# Altium project RocketFPGA.PrjPcb
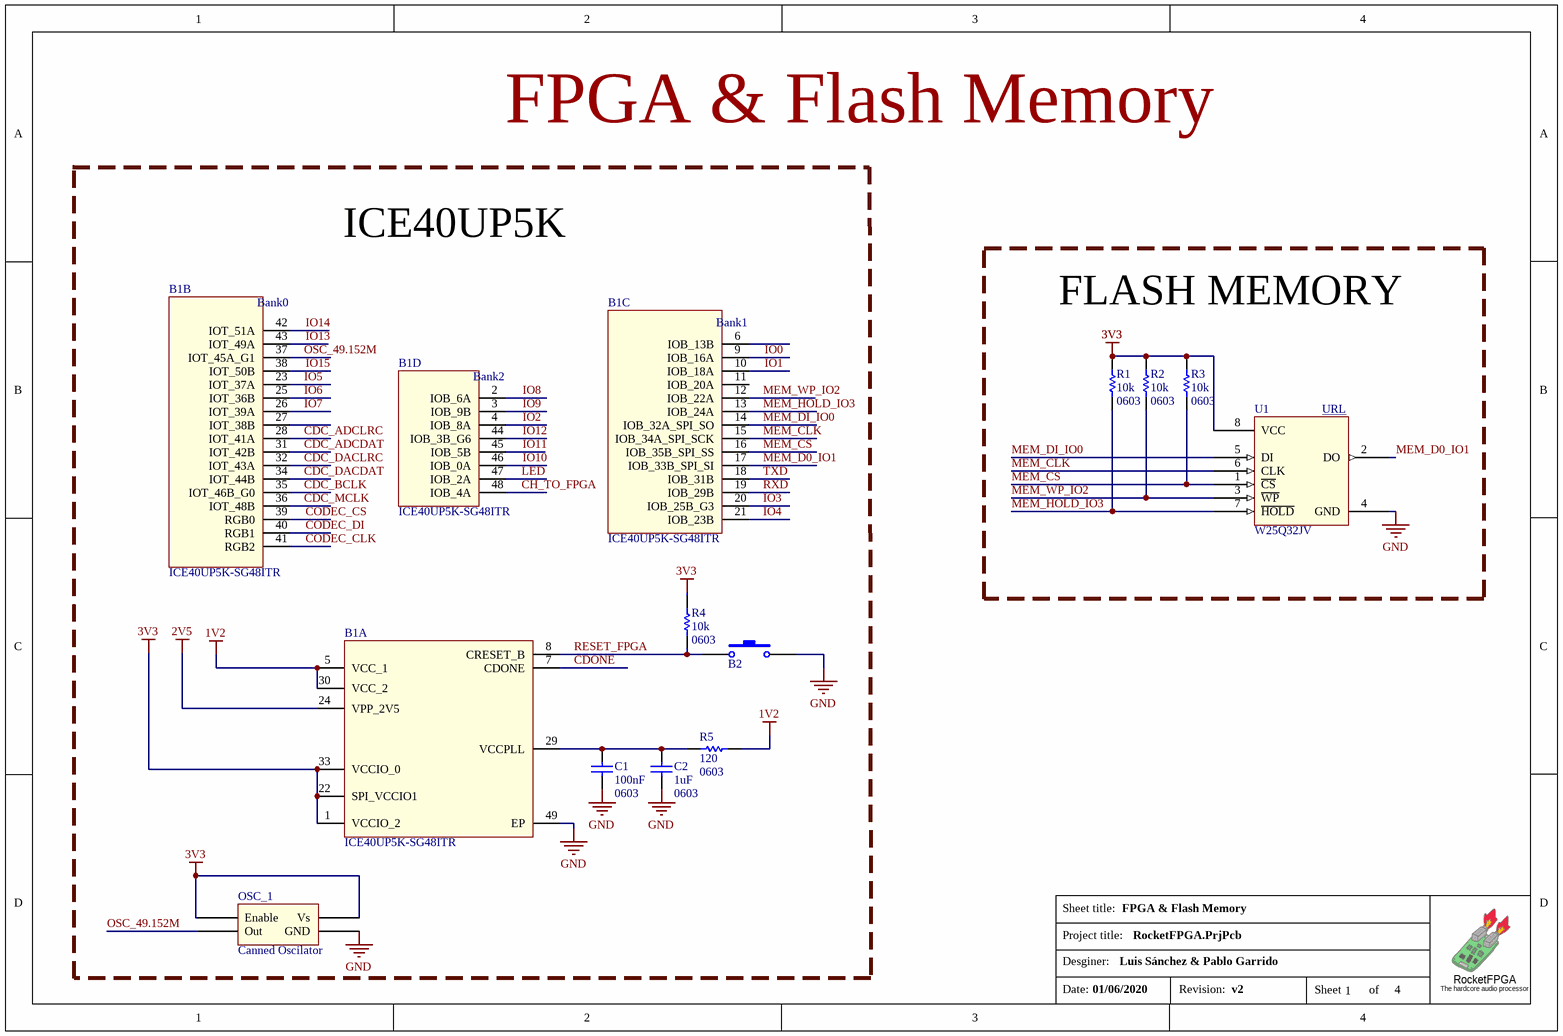
[diagram p0: 01_FPGA_FlashMem.SchDoc]
author_name: Luis Sánchez & Pablo Garrido; release_date: 01/06/2020; revision_no: v2
4 sheets, 58 parts. Net scope: global (net labels, ports and power ports of the same name join across sheets).
Board files: panel.PcbDoc, RocketFPGA.PcbDoc
Sheets:
  01_FPGA_FlashMem.SchDoc
  02_USB_MCU.SchDoc
  03_Power_IO.SchDoc
  04_AudioCodec.SchDoc

## Sheet 01_FPGA_FlashMem.SchDoc: FPGA & Flash Memory
size A4; Date: 08/06/2019; Author: Luis Sánchez Velasco; DocumentNumber: 1; Revision: 0; SheetNumber: 1; SheetTotal: 4; sheet_title: FPGA & Flash Memory

### Parts
(Parts that share a designator on the sheet are numbered #1, #2 ... from top to bottom, then left to right.)
B1  ICE40UP5K-SG48ITR  [QFN50P700X700X100-49N-D]  (parts A,B,C,D of 4)
B2  FSM6JH  [SMD_PUSHBUTTON_3x6x2mm5]  (value not drawn)
C1  value 100nF  Package: 0603  [0603 CAP]  (hidden comment: Ceramic capacitor)
C2  value 1uF  Package: 0603  [0603 CAP]  (hidden comment: Ceramic capacitor)
OSC_1#1  Canned Oscilator  [canned oscillator small]
R1  value 10k  Package: 0603  [Resistencia 0603]  (hidden comment: Resistor)
R2  value 10k  Package: 0603  [Resistencia 0603]  (hidden comment: Resistor)
R3  value 10k  Package: 0603  [Resistencia 0603]  (hidden comment: Resistor)
R4  value 10k  Package: 0603  [Resistencia 0603]  (hidden comment: Resistor)
R5  value 120  Package: 0603  [Resistencia 0603]  (hidden comment: Resistor)
U1  W25Q32JV  [W25Q32J]

### Blocks framed on the sheet
ICE40UP5K: B1 B2 C1 C2 OSC_1#1 R4 R5
FLASH MEMORY: R1-R3 U1

### Nets
1V2: B1.5(VCC_1) B1.30(VCC_2) R5.2
2V5: B1.24(VPP_2V5)
3V3: B1.1(VCCIO_2) B1.22(SPI_VCCIO1) B1.33(VCCIO_0) OSC_1#1.1(Enable) OSC_1#1.4(Vs) R1.2 R2.2 R3.2 R4.2 U1.8(VCC)
GND: B1.49(EP) B2.2 C1.1 C2.1 OSC_1#1.2(GND) U1.4(GND)
CDC_ADCDAT: B1.31(IOT_42B)
CDC_ADCLRC: B1.28(IOT_41A)
CDC_BCLK: B1.35(IOT_46B_G0)
CDC_DACDAT: B1.34(IOT_44B)
CDC_DACLRC: B1.32(IOT_43A)
CDC_MCLK: B1.36(IOT_48B)
CDONE: B1.7(CDONE)
CH_TO_FPGA: B1.48(IOB_4A)
CODEC_CLK: B1.41(RGB2)
CODEC_CS: B1.39(RGB0)
CODEC_DI: B1.40(RGB1)
IO0: B1.9(IOB_16A)
IO1: B1.10(IOB_18A)
IO2: B1.4(IOB_8A)
IO3: B1.20(IOB_25B_G3)
IO4: B1.21(IOB_23B)
IO5: B1.23(IOT_37A)
IO6: B1.25(IOT_36B)
IO7: B1.26(IOT_39A)
IO8: B1.2(IOB_6A)
IO9: B1.3(IOB_9B)
IO10: B1.46(IOB_0A)
IO11: B1.45(IOB_5B)
IO12: B1.44(IOB_3B_G6)
IO13: B1.43(IOT_49A)
IO14: B1.42(IOT_51A)
IO15: B1.38(IOT_50B)
LED: B1.47(IOB_2A)
MEM_CLK: B1.15(IOB_34A_SPI_SCK) U1.6(CLK)
MEM_CS: B1.16(IOB_35B_SPI_SS) R3.1 U1.1(~{CS})
MEM_D0_IO1: B1.17(IOB_33B_SPI_SI) U1.2(DO)
MEM_DI_IO0: B1.14(IOB_32A_SPI_SO) U1.5(DI)
MEM_HOLD_IO3: B1.13(IOB_24A) R1.1 U1.7(~{HOLD})
MEM_WP_IO2: B1.12(IOB_22A) R2.1 U1.3(~{WP})
OSC_49.152M: B1.37(IOT_45A_G1) OSC_1#1.3(Out)
RESET_FPGA: B1.8(CRESET_B) B2.1 R4.1
RXD: B1.19(IOB_29B)
TXD: B1.18(IOB_31B)
NetB1_29: B1.29(VCCPLL) C1.2 C2.2 R5.1

Not connected (* = marked no-connect by the designer): B1 6(IOB_13B) 11(IOB_20A) 27(IOT_38B)

### Notes on the sheet
- FPGA & Flash Memory
- (near U1) URL <https://eu.mouser.com/ProductDetail/STMicroelectronics/M95M02-DWMN3TP-K?qs=sGAEpiMZZMuVhdAcoizlRYly6JnwLZjJGi2czB2d%252bG8%3d>
- Sheet title:
- Project title:
- Desginer:
- The hardcore audio processor
- RocketFPGA
- Date:
- Revision:
- Sheet
- of
- (in symbol ICE40UP5K-SG48ITR, part B) Bank0
- (in symbol ICE40UP5K-SG48ITR, part C) Bank1
- (in symbol ICE40UP5K-SG48ITR, part D) Bank2

### Library data of the parts
B1 = ICE40UP5K-SG48ITR: FPGA - Field Programmable Gate Array iCE40-UltraPlus, 5280 LUTs, 1.2V; Vendor: Mouser; Link: https://www.mouser.es/ProductDetail/Lattice/ICE40UP5K-SG48I?qs=Rp3RbKSfAt3UqOG1AN4%2FAg%3D%3D
B2 = FSM6JH: Button THT Switch; vendor: Mouser; vendorID: 611-PTS636SL43SMTRLF; Supplier 1: Mouser; Supplier Part Number 1: 506-FSM6JH; price: 0.096
C1 = Capacitor: vendor: LCSC; vendorID: 0603F104M500NT; Supplier 1: Mouser; Supplier Part Number 1: 80-C1206C104K5R; ManufacturerReference: -; price: 0.0023
C2 = Capacitor: vendor: LCSC; vendorID: CC0603ZRY5V7BB105; Supplier 1: Mouser; Supplier Part Number 1: 80-C1206C104K5R; ManufacturerReference: -; price: 0.0053
OSC_1#1 = Canned Oscilator: Canned Oscilator -LFSPXO019116BULK; Vendor: LCSC; Link: https://lcsc.com/product-detail/SMD-Oscillators-XO_Shenzhen-SCTF-Elec-S3D49-152000B20F30T_C387443.html
R1-R4 = Resistor: vendor: LCSC; vendorID: 0603WAF1002T5E; Supplier 1: Farnell; Supplier Part Number 1: 2358436; ManufacturerReference: -; price: 0.0009
  R1: Parameter 1: *
R5 = Resistor: vendor2: vendor; vendor: LCSC; vendorID: CR0603FA1200G; Supplier 1: Farnell; Supplier Part Number 1: 2358436; ManufacturerReference: -; price: 0.0024
U1 = W25Q32JV: 32M-BIT SERIAL FLASH MEMORY WITH DUAL AND QUAD SPI; Vendor: LCSC; Link: https://lcsc.com/product-detail/FLASH_Winbond-Elec-W25Q32JVSSIQ_C82344.html

## Sheet 02_USB_MCU.SchDoc: USB & Microcontroller
size A4; Date: 08/06/2019; Author: Luis Sánchez Velasco; DocumentNumber: 2; Revision: 0; SheetNumber: 2; SheetTotal: 4; sheet_title: USB Microcontroller
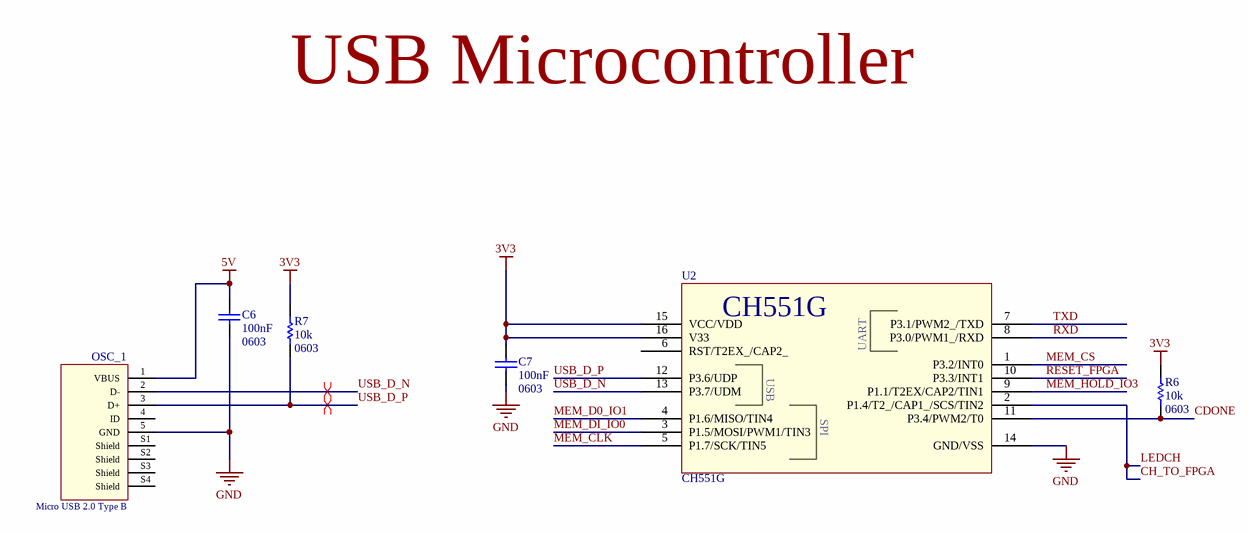
[diagram p1: 02_USB_MCU.SchDoc]

### Parts
(Parts that share a designator on the sheet are numbered #1, #2 ... from top to bottom, then left to right.)
C6  value 100nF  Package: 0603  [0603 CAP]  (hidden comment: Ceramic capacitor)
C7  value 100nF  Package: 0603  [0603 CAP]  (hidden comment: Ceramic capacitor)
OSC_1#2  Micro USB 2.0 Type B  [629105136821]
R6  value 10k  Package: 0603  [Resistencia 0603]  (hidden comment: Resistor)
R7  value 10k  Package: 0603  [Resistencia 0603]  (hidden comment: Resistor)
U2  CH551G  [CH551]

### Nets
3V3: C7.1 R6.2 R7.1 U2.15(VCC/VDD) U2.16(V33)
5V: C6.1 OSC_1#2.1(VBUS)
GND: C6.2 C7.2 OSC_1#2.5(GND) U2.14(GND/VSS)
CDONE: R6.1 U2.11(P3.4/PWM2/T0)
CH_TO_FPGA: U2.2(P1.4/T2_/CAP1_/SCS/TIN2)  [also labelled LEDCH]
MEM_CLK: U2.5(P1.7/SCK/TIN5)
MEM_CS: U2.1(P3.2/INT0)
MEM_D0_IO1: U2.4(P1.6/MISO/TIN4)
MEM_DI_IO0: U2.3(P1.5/MOSI/PWM1/TIN3)
MEM_HOLD_IO3: U2.9(P1.1/T2EX/CAP2/TIN1)
RESET_FPGA: U2.10(P3.3/INT1)
RXD: U2.8(P3.0/PWM1_/RXD)
TXD: U2.7(P3.1/PWM2_/TXD)
USB_D_N: OSC_1#2.2(D-) U2.13(P3.7/UDM)
USB_D_P: OSC_1#2.3(D+) R7.2 U2.12(P3.6/UDP)

Not connected (* = marked no-connect by the designer): OSC_1#2 4(ID) S1(Shield) S2(Shield) S3(Shield) S4(Shield); U2 6(RST/T2EX_/CAP2_)

### Layout directives
differential pair: USB_D_N, USB_D_P

### Notes on the sheet
- USB Microcontroller
- Sheet title:
- Project title:
- Desginer:
- The hardcore audio processor
- RocketFPGA
- Date:
- Revision:
- Sheet
- of
- (in symbol CH551G) UART; USB; SPI

### Library data of the parts
C6 C7 = Capacitor: vendor: LCSC; vendorID: 0603F104M500NT; Supplier 1: Mouser; Supplier Part Number 1: 80-C1206C104K5R; ManufacturerReference: -; price: 0.0023
OSC_1#2 = 629105136821: Micro USB 2.0 Type B Horizontal SMT 5 Contacts WR-COM; Vendor: LCSC; Vendor 2: Mouser; Link: https://lcsc.com/product-detail/USB-Connectors_Jing-Extension-of-the-Electronic-Co-Jing-Extension-of-the-Electronic-Co-micro-5PAll-posts-are-not-guided-Flat-welding-High-temperature_C77238.html; ComponentLink1Description: Manufacturer; ComponentLink1URL: http://www.we-online.de; ComponentLink2Description: Datasheet; ComponentLink2URL: http://katalog.we-online.de/em/datasheet/629105136821.pdf; Link 2: https://www.mouser.es/ProductDetail/Wurth-Elektronik/629105136821?qs=%2Fha2pyFaduiBjBt32de63eUvWSiL1Vrl53OTMO%252B7qnQKl4r3Xe3wDQ%3D%3D
R6 R7 = Resistor: vendor: LCSC; vendorID: 0603WAF1002T5E; Supplier 1: Farnell; Supplier Part Number 1: 2358436; ManufacturerReference: -; price: 0.0009
  R6: Parameter 1: *
U2 = CH551G: Microcontroller wUSB support; Vendor: LCSC; ComponentLink1Description: LCSC; ComponentLink1URL: https://lcsc.com/product-detail/USB_CH551G_C108958.html; Link: https://lcsc.com/product-detail/WCH_WCH-Jiangsu-Qin-Heng-CH551G_C108958.html

## Sheet 03_Power_IO.SchDoc
size A4; sheet_title: Power & IO; DocumentNumber: 3; SheetNumber: 3; SheetTotal: 4
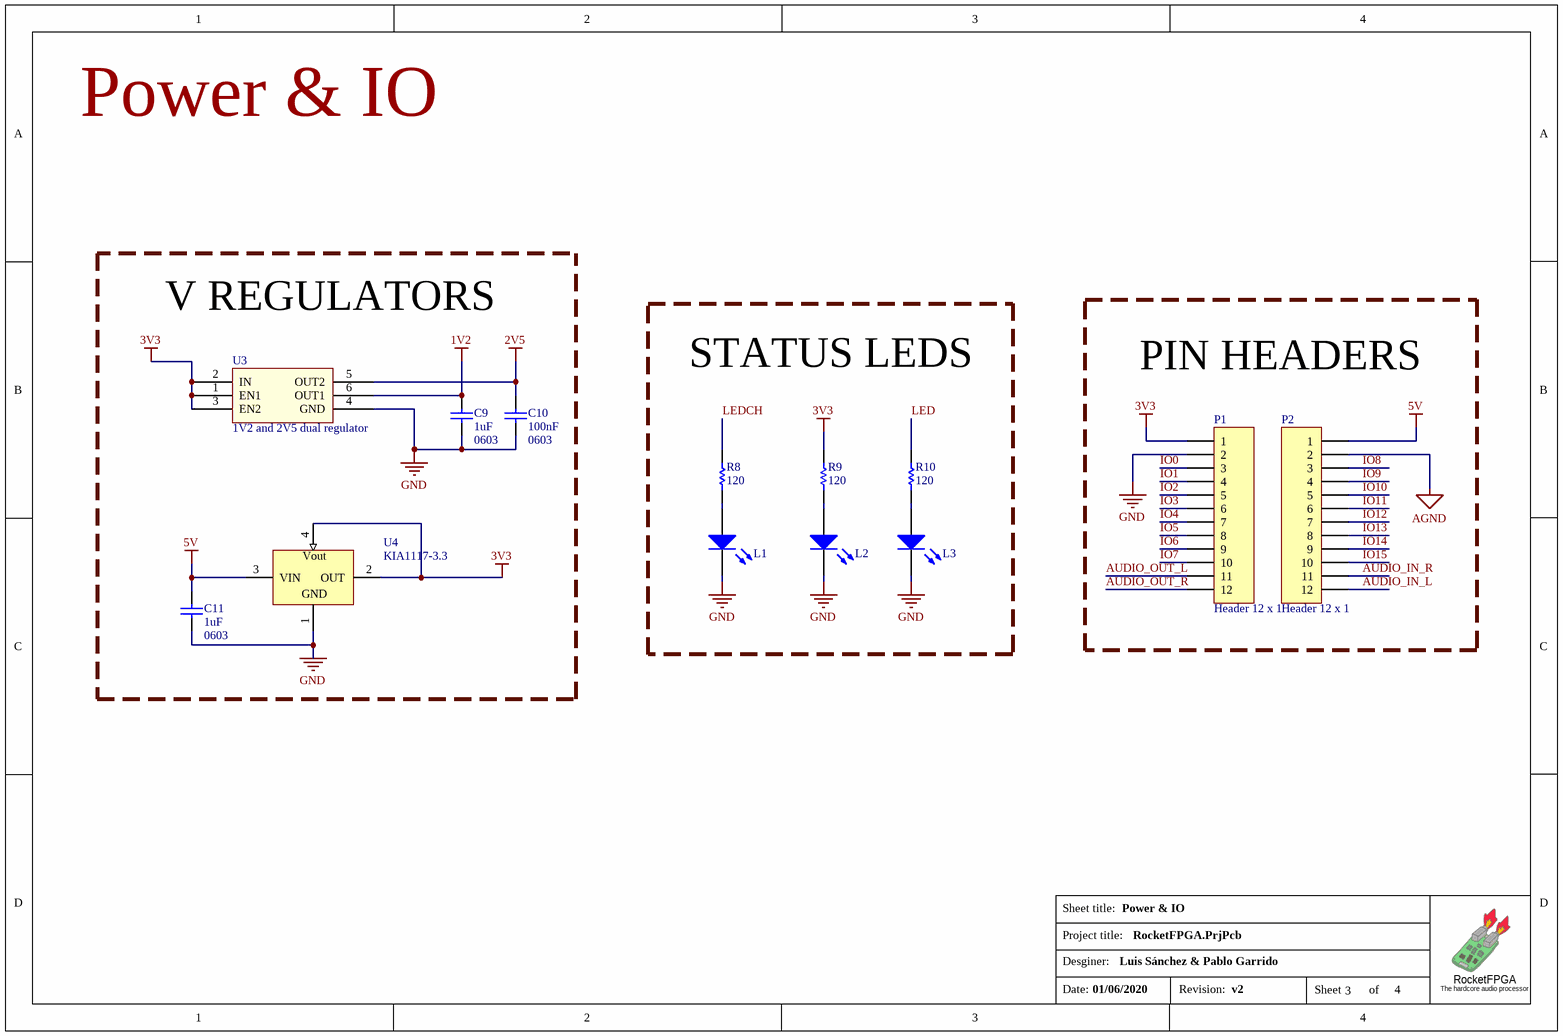
[diagram p2: 03_Power_IO.SchDoc]

### Parts
C9  value 1uF  Package: 0603  [0603 CAP]  (hidden comment: Ceramic capacitor)
C10  value 100nF  Package: 0603  [0603 CAP]  (hidden comment: Ceramic capacitor)
C11  value 1uF  Package: 0603  [0603 CAP]  (hidden comment: Ceramic capacitor)
L1  LED_SMD  [0805]  (value not drawn)
L2  LED_SMD  [0805]  (value not drawn)
L3  LED_SMD  [0805]  (value not drawn)
P1  Header 12 x 1  [HDR1X12]
P2  Header 12 x 1  [HDR1X12]
R8  value 120  [Resistencia 0603]  (hidden comment: Resistor)
R9  value 120  [Resistencia 0603]  (hidden comment: Resistor)
R10  value 120  [Resistencia 0603]  (hidden comment: Resistor)
U3  1V2 and 2V5 dual regulator  [DSE 6]
U4  KIA1117-3.3  [SOT-223]

### Blocks framed on the sheet
PIN HEADERS: P1 P2
STATUS LEDS: L1-L3 R8-R10

### Nets
1V2: C9.1 U3.6(OUT1)
2V5: C10.1 U3.5(OUT2)
3V3: P1.1 R9.2 U3.1(EN1) U3.2(IN) U3.3(EN2) U4.2(OUT) U4.4(Vout)
5V: C11.1 P2.1 U4.3(VIN)
AGND: P2.2
GND: C9.2 C10.2 C11.2 L1.2(K) L2.2(K) L3.2(K) P1.2 U3.4(GND) U4.1(GND)
AUDIO_IN_L: P2.12
AUDIO_IN_R: P2.11
AUDIO_OUT_L: P1.11
AUDIO_OUT_R: P1.12
IO0: P1.3
IO1: P1.4
IO2: P1.5
IO3: P1.6
IO4: P1.7
IO5: P1.8
IO6: P1.9
IO7: P1.10
IO8: P2.3
IO9: P2.4
IO10: P2.5
IO11: P2.6
IO12: P2.7
IO13: P2.8
IO14: P2.9
IO15: P2.10
LED: R10.2
LEDCH: R8.2  [project net CH_TO_FPGA]
NetL1_1: L1.1(A) R8.1
NetL2_1: L2.1(A) R9.1
NetL3_1: L3.1(A) R10.1

### Notes on the sheet
- Power & IO
- V REGULATORS
- Sheet title:
- Project title:
- Desginer:
- The hardcore audio processor
- RocketFPGA
- Date:
- Revision:
- Sheet
- of

### Library data of the parts
C9 C11 = Capacitor: as C2 on sheet 01_FPGA_FlashMem; Supplier 1: Mouser; Supplier Part Number 1: 80-C1206C104K5R; ManufacturerReference: -; price: 0.0053
C10 = Capacitor: vendor: LCSC; vendorID: 0603F104M500NT; Supplier 1: Mouser; Supplier Part Number 1: 80-C1206C104K5R; ManufacturerReference: -; price: 0.0023
L1-L3 = LED_SMD: LED SMD; vendor: Mouser; vendorID: 743-IN-S85AT5B; Supplier 1: Mouser; Supplier Part Number 1: 630-HSMC-C170; price: 0.087
P1 P2 = Header 12_1: Header, 11-Pin; Vendor: LCSC; Link: https://lcsc.com/product-detail/Pin-Header-Female-Header_CJT-Changjiang-Connectors-A2541WV-12P_C225487.html
R8-R10 = Resistor: as R5 on sheet 01_FPGA_FlashMem; Supplier 1: Farnell; Supplier Part Number 1: 2358436; price: 0.0024
U3 = TLV7111225DSER: Vendor: LCSC; Link: https://lcsc.com/product-detail/Low-Dropout-Regulators-LDO_Texas-Instruments-TLV7111225DSER_C201579.html
U4 = KIA1117-3.3: 5V to 3.3V 800mA Low-Dropout Linear Regulator; Vendor: LCSC; Link: https://lcsc.com/product-detail/Low-Dropout-Regulators-LDO_PUOLOP-AMS1117-3-3_C351784.html

## Sheet 04_AudioCodec.SchDoc
size A4; DocumentNumber: 4; SheetNumber: 4; SheetTotal: 4; sheet_title: Audio Codec
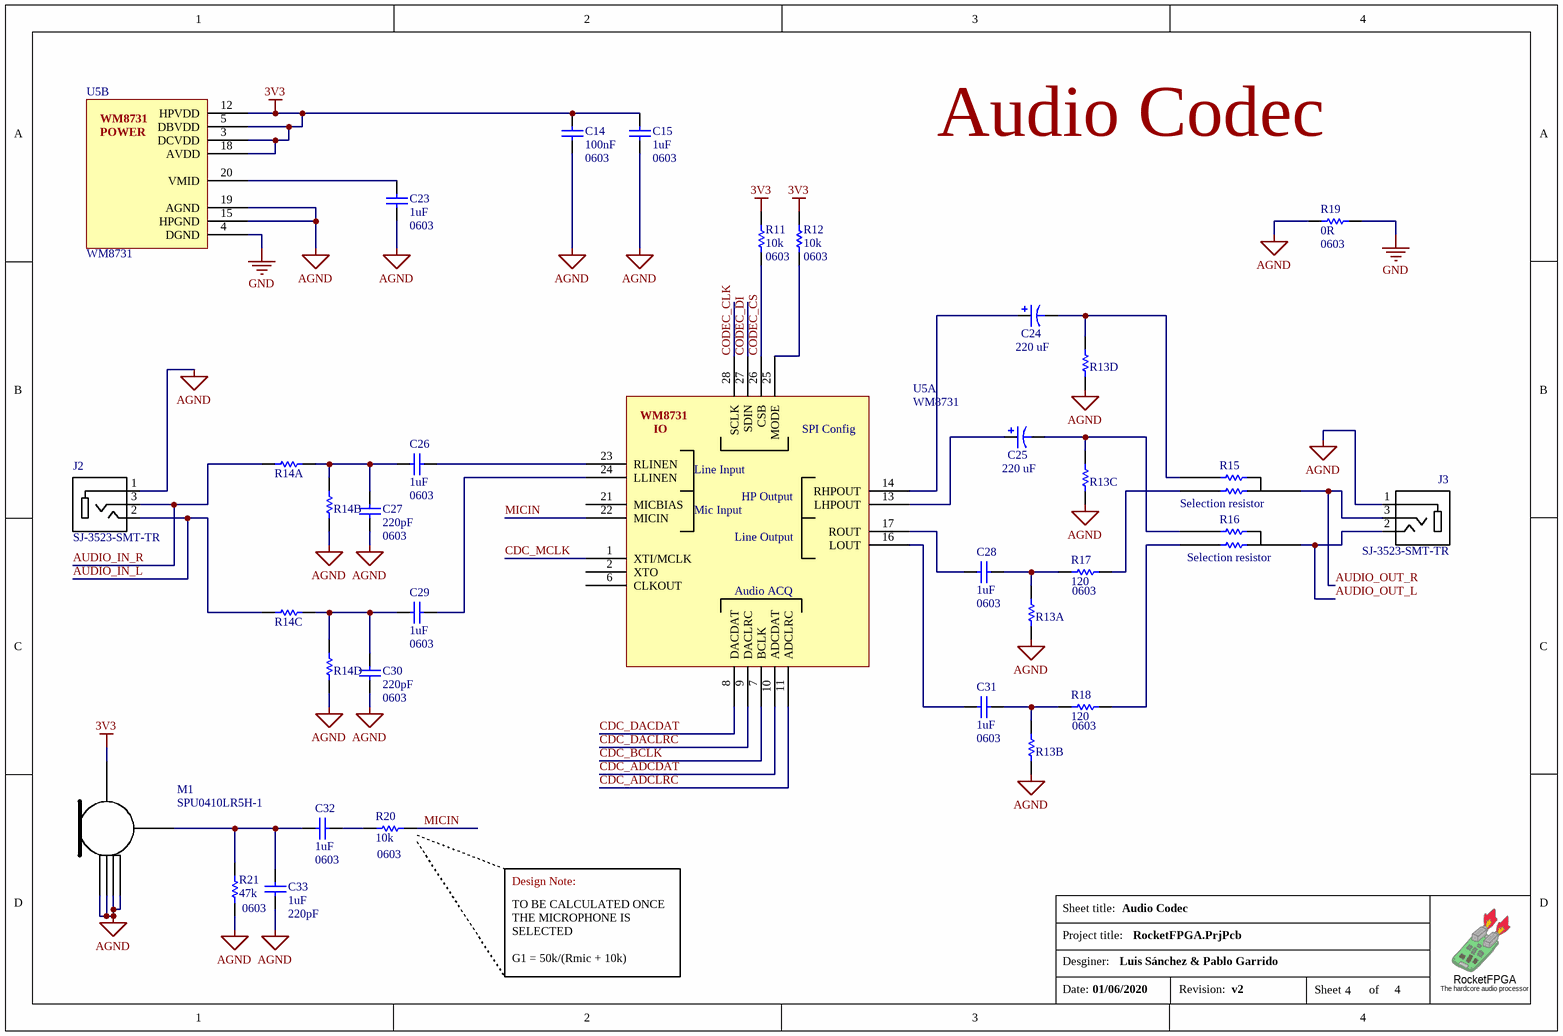
[diagram p3: 04_AudioCodec.SchDoc]

### Parts
C14  value 100nF  Package: 0603  [0603 CAP]  (hidden comment: Ceramic capacitor)
C15  value 1uF  Package: 0603  [0603 CAP]  (hidden comment: Ceramic capacitor)
C23  value 1uF  Package: 0603  [0603 CAP]  (hidden comment: Ceramic capacitor)
C24  value 220 uF  [CAPCP3216X16N]  (hidden comment: Capacitor Electrolitic)
C25  value 220 uF  [CAPCP3216X16N]  (hidden comment: Capacitor Electrolitic)
C26  value 1uF  Package: 0603  [0603 CAP]  (hidden comment: Ceramic capacitor)
C27  value 220pF  Package: 0603  [0603 CAP]  (hidden comment: Ceramic capacitor)
C28  value 1uF  Package: 0603  [0603 CAP]  (hidden comment: Ceramic capacitor)
C29  value 1uF  Package: 0603  [0603 CAP]  (hidden comment: Ceramic capacitor)
C30  value 220pF  Package: 0603  [0603 CAP]  (hidden comment: Ceramic capacitor)
C31  value 1uF  Package: 0603  [0603 CAP]  (hidden comment: Ceramic capacitor)
C32  value 1uF  Package: 0603  [0603 CAP]  (hidden comment: Ceramic capacitor)
C33  value 1uF  Package: 220pF  [0603 CAP]  (hidden comment: Ceramic capacitor)
J2  SJ-3523-SMT-TR  [CUI_SJ-3523-SMT-TR]
J3  SJ-3523-SMT-TR  [CUI_SJ-3523-SMT-TR]
M1  SPU0410LR5H-1  [SPU0410LR5H-1]
R11  value 10k  Package: 0603  [Resistencia 0603]  (hidden comment: Resistor)
R12  value 10k  Package: 0603  [Resistencia 0603]  (hidden comment: Resistor)
R13  Resistor array  (value not drawn)  (parts A,B,C,D of 4)
R14  Resistor array  (value not drawn)  (parts A,B,C,D of 4)
R15  Selection resistor
R16  Selection resistor
R17  value 120  Package: 0603  [Resistencia 0603]  (hidden comment: Resistor)
R18  value 120  Package: 0603  [Resistencia 0603]  (hidden comment: Resistor)
R19  value 0R  Package: 0603  [Resistencia 0603]  (hidden comment: Resistor)
R20  value 10k  Package: 0603  [Resistencia 0603]  (hidden comment: Resistor)
R21  value 47k  Package: 0603  [Resistencia 0603]  (hidden comment: Resistor)
U5  WM8731  [WM8731]  (parts A,B of 2)

### Nets
3V3: C14.1 C15.1 M1.4 R11.2 R12.2 U5.3(DCVDD) U5.5(DBVDD) U5.12(HPVDD) U5.18(AVDD)
AGND: C14.2 C15.2 C23.2 C27.2 C30.2 C33.2 J2.1 J3.1 M1.2 M1.3 M1.5 M1.6 R13.5 R13.6 R13.7 R13.8 R14.2 R14.4 R19.2 R21.1 U5.15(HPGND) U5.19(AGND)
GND: R19.1 U5.4(DGND)
AUDIO_IN_L: J2.2 R14.3
AUDIO_IN_R: J2.3 R14.1
AUDIO_OUT_L: J3.2 R16.2
AUDIO_OUT_R: J3.3 R15.2
CDC_ADCDAT: U5.10(ADCDAT)
CDC_ADCLRC: U5.11(ADCLRC)
CDC_BCLK: U5.7(BCLK)
CDC_DACDAT: U5.8(DACDAT)
CDC_DACLRC: U5.9(DACLRC)
CDC_MCLK: U5.1(XTI/MCLK)
CODEC_CLK: U5.28(SCLK)
CODEC_CS: R11.1 U5.26(CSB)
CODEC_DI: U5.27(SDIN)
MICIN: R20.2 U5.22(MICIN)
NetC23_1: C23.1 U5.20(VMID)
NetC24_1: C24.1 U5.14(RHPOUT)
NetC24_2: C24.2 R13.4 R15.1
NetC25_1: C25.1 U5.13(LHPOUT)
NetC25_2: C25.2 R13.3 R16.1
NetC26_1: C26.1 C27.1 R14.7 R14.8
NetC26_2: C26.2 U5.23(RLINEN)
NetC28_1: C28.1 U5.17(ROUT)
NetC28_2: C28.2 R13.1 R17.1
NetC29_1: C29.1 U5.24(LLINEN)
NetC29_2: C29.2 C30.1 R14.5 R14.6
NetC31_1: C31.1 U5.16(LOUT)
NetC31_2: C31.2 R13.2 R18.1
NetC32_1: C32.1 R20.1
NetC32_2: C32.2 C33.1 M1.1 R21.2
NetR12_1: R12.1 U5.25(MODE)
NetR15_3: R15.3 R17.2
NetR16_3: R16.3 R18.2

Not connected (* = marked no-connect by the designer): U5 2(XTO) 6(CLKOUT) 21(MICBIAS)

### Notes on the sheet
- Audio Codec
- Design Note:
- TO BE CALCULATED ONCE THE MICROPHONE IS SELECTED
  G1 = 50k/(Rmic + 10k)
- Sheet title:
- Project title:
- Desginer:
- The hardcore audio processor
- RocketFPGA
- Date:
- Revision:
- Sheet
- of
- (in symbol WM8731, part A) IO; SPI Config; Line Input; HP Output; Mic Input; Line Output; Audio ACQ
- (in symbol WM8731, part B) POWER

### Library data of the parts
C14 = Capacitor: vendor: LCSC; vendorID: 0603F104M500NT; Supplier 1: Mouser; Supplier Part Number 1: 80-C1206C104K5R; ManufacturerReference: -; price: 0.0023
C15 C23 C26 C28 C29 C31-C33 = Capacitor: as C2 on sheet 01_FPGA_FlashMem; Supplier 1: Mouser; Supplier Part Number 1: 80-C1206C104K5R; ManufacturerReference: -; price: 0.0053
C24 C25 = Capacitor Electrolitic: Vendor: LCSC; Author: Jaime Jiménez Ortega; Date: 21/05/2009; Link: https://lcsc.com/product-detail/Others_TANCAP-Tech-CA45-227M004BT_C327726.html
C27 C30 = Capacitor: vendor: LCSC; vendorID: 0603B221K500NT; Supplier 1: Mouser; Supplier Part Number 1: 80-C1206C104K5R; ManufacturerReference: -; price: 0.0035
J2 = SJ-3523-SMT-TR: Jack connector; vendor: Mouser; Vendor 2: LCSC; Link 2: https://lcsc.com/product-detail/Audio-Video-Connectors_BOOMELE-Boom-Precision-Elec-PJ-320B_C18594.html; Link: https://www.mouser.es/ProductDetail/CUI-Devices/SJ-3523-SMT-TR?qs=WyjlAZoYn51zOHzJ3r4ZRA%3D%3D
J3 = SJ-3523-SMT-TR: vendor: Mouser; vendorID: 490-SJ-3523-SMT-TR; ManufacturerReference: SJ-3523-SMT-TR; Package: -; price: 0.777
M1 = SPU0410LR5H-1: MEMS Microphone; Vendor: Mouser; Link: https://www.mouser.es/ProductDetail/Knowles/SPU0410LR5H-QB?qs=%2Fha2pyFadujsOyq9m86PskfJJTo%2F6w8gLVlLZDQM1tgnAEafFx2amg%3D%3D
R11 R12 R20 = Resistor: vendor: LCSC; vendorID: 0603WAF1002T5E; Supplier 1: Farnell; Supplier Part Number 1: 2358436; ManufacturerReference: -; price: 0.0009
R13 R14 = ResistorArray_4: 4 resistors in smd array configuration; Vendor: LCSC; Link: https://lcsc.com/product-detail/Resistor-Networks-Arrays_BOURNS_CAT10-562J4LF_BOURNS-CAT10-562J4LF_C148532.html; Link 2: https://lcsc.com/product-detail/Resistor-Networks-Arrays_BOURNS_CAT10-473J4LF_47KR-473-5_C148526.html
R15 R16 = SelectionResistor
R17 R18 = Resistor: vendor: LCSC; vendorID: CR0603FA1200G; Supplier 1: Farnell; Supplier Part Number 1: 2358436; ManufacturerReference: -; price: 0.0024
R19 R21 = Resistor: vendor: LCSC; vendorID: RS-03K473JT; Supplier 1: Farnell; Supplier Part Number 1: 2358436; ManufacturerReference: -; price: 0.0007
U5 = WM8731: Portable Internet Audio CODEC with Headphone Driver  and Programmable Sample Rates; Vendor: Mouser; Link: https://www.mouser.es/ProductDetail/Cirrus-Logic/WM8731CSEFL?qs=3kEcuH7qFhd2WZOaNm6tsA%3D%3D

## Nets that join several sheets
1V2: 01_FPGA_FlashMem (B1.5 B1.30 R5.2), 03_Power_IO (C9.1 U3.6)
2V5: 01_FPGA_FlashMem (B1.24), 03_Power_IO (C10.1 U3.5)
3V3: 01_FPGA_FlashMem (10 pins), 02_USB_MCU (5 pins), 03_Power_IO (7 pins), 04_AudioCodec (9 pins)
5V: 02_USB_MCU (C6.1 OSC_1#2.1), 03_Power_IO (C11.1 P2.1 U4.3)
AGND: 03_Power_IO (P2.2), 04_AudioCodec (22 pins)
GND: 01_FPGA_FlashMem (6 pins), 02_USB_MCU (C6.2 C7.2 OSC_1#2.5 U2.14), 03_Power_IO (9 pins), 04_AudioCodec (R19.1 U5.4)
AUDIO_IN_L: 03_Power_IO (P2.12), 04_AudioCodec (J2.2 R14.3)
AUDIO_IN_R: 03_Power_IO (P2.11), 04_AudioCodec (J2.3 R14.1)
AUDIO_OUT_L: 03_Power_IO (P1.11), 04_AudioCodec (J3.2 R16.2)
AUDIO_OUT_R: 03_Power_IO (P1.12), 04_AudioCodec (J3.3 R15.2)
CDC_ADCDAT: 01_FPGA_FlashMem (B1.31), 04_AudioCodec (U5.10)
CDC_ADCLRC: 01_FPGA_FlashMem (B1.28), 04_AudioCodec (U5.11)
CDC_BCLK: 01_FPGA_FlashMem (B1.35), 04_AudioCodec (U5.7)
CDC_DACDAT: 01_FPGA_FlashMem (B1.34), 04_AudioCodec (U5.8)
CDC_DACLRC: 01_FPGA_FlashMem (B1.32), 04_AudioCodec (U5.9)
CDC_MCLK: 01_FPGA_FlashMem (B1.36), 04_AudioCodec (U5.1)
CDONE: 01_FPGA_FlashMem (B1.7), 02_USB_MCU (R6.1 U2.11)
CH_TO_FPGA: 01_FPGA_FlashMem (B1.48), 02_USB_MCU (U2.2), 03_Power_IO (R8.2)
CODEC_CLK: 01_FPGA_FlashMem (B1.41), 04_AudioCodec (U5.28)
CODEC_CS: 01_FPGA_FlashMem (B1.39), 04_AudioCodec (R11.1 U5.26)
CODEC_DI: 01_FPGA_FlashMem (B1.40), 04_AudioCodec (U5.27)
IO0: 01_FPGA_FlashMem (B1.9), 03_Power_IO (P1.3)
IO1: 01_FPGA_FlashMem (B1.10), 03_Power_IO (P1.4)
IO2: 01_FPGA_FlashMem (B1.4), 03_Power_IO (P1.5)
IO3: 01_FPGA_FlashMem (B1.20), 03_Power_IO (P1.6)
IO4: 01_FPGA_FlashMem (B1.21), 03_Power_IO (P1.7)
IO5: 01_FPGA_FlashMem (B1.23), 03_Power_IO (P1.8)
IO6: 01_FPGA_FlashMem (B1.25), 03_Power_IO (P1.9)
IO7: 01_FPGA_FlashMem (B1.26), 03_Power_IO (P1.10)
IO8: 01_FPGA_FlashMem (B1.2), 03_Power_IO (P2.3)
IO9: 01_FPGA_FlashMem (B1.3), 03_Power_IO (P2.4)
IO10: 01_FPGA_FlashMem (B1.46), 03_Power_IO (P2.5)
IO11: 01_FPGA_FlashMem (B1.45), 03_Power_IO (P2.6)
IO12: 01_FPGA_FlashMem (B1.44), 03_Power_IO (P2.7)
IO13: 01_FPGA_FlashMem (B1.43), 03_Power_IO (P2.8)
IO14: 01_FPGA_FlashMem (B1.42), 03_Power_IO (P2.9)
IO15: 01_FPGA_FlashMem (B1.38), 03_Power_IO (P2.10)
LED: 01_FPGA_FlashMem (B1.47), 03_Power_IO (R10.2)
MEM_CLK: 01_FPGA_FlashMem (B1.15 U1.6), 02_USB_MCU (U2.5)
MEM_CS: 01_FPGA_FlashMem (B1.16 R3.1 U1.1), 02_USB_MCU (U2.1)
MEM_D0_IO1: 01_FPGA_FlashMem (B1.17 U1.2), 02_USB_MCU (U2.4)
MEM_DI_IO0: 01_FPGA_FlashMem (B1.14 U1.5), 02_USB_MCU (U2.3)
MEM_HOLD_IO3: 01_FPGA_FlashMem (B1.13 R1.1 U1.7), 02_USB_MCU (U2.9)
RESET_FPGA: 01_FPGA_FlashMem (B1.8 B2.1 R4.1), 02_USB_MCU (U2.10)
RXD: 01_FPGA_FlashMem (B1.19), 02_USB_MCU (U2.8)
TXD: 01_FPGA_FlashMem (B1.18), 02_USB_MCU (U2.7)